# Altium schematic sheet [2] - PWR.SchDoc
size A4
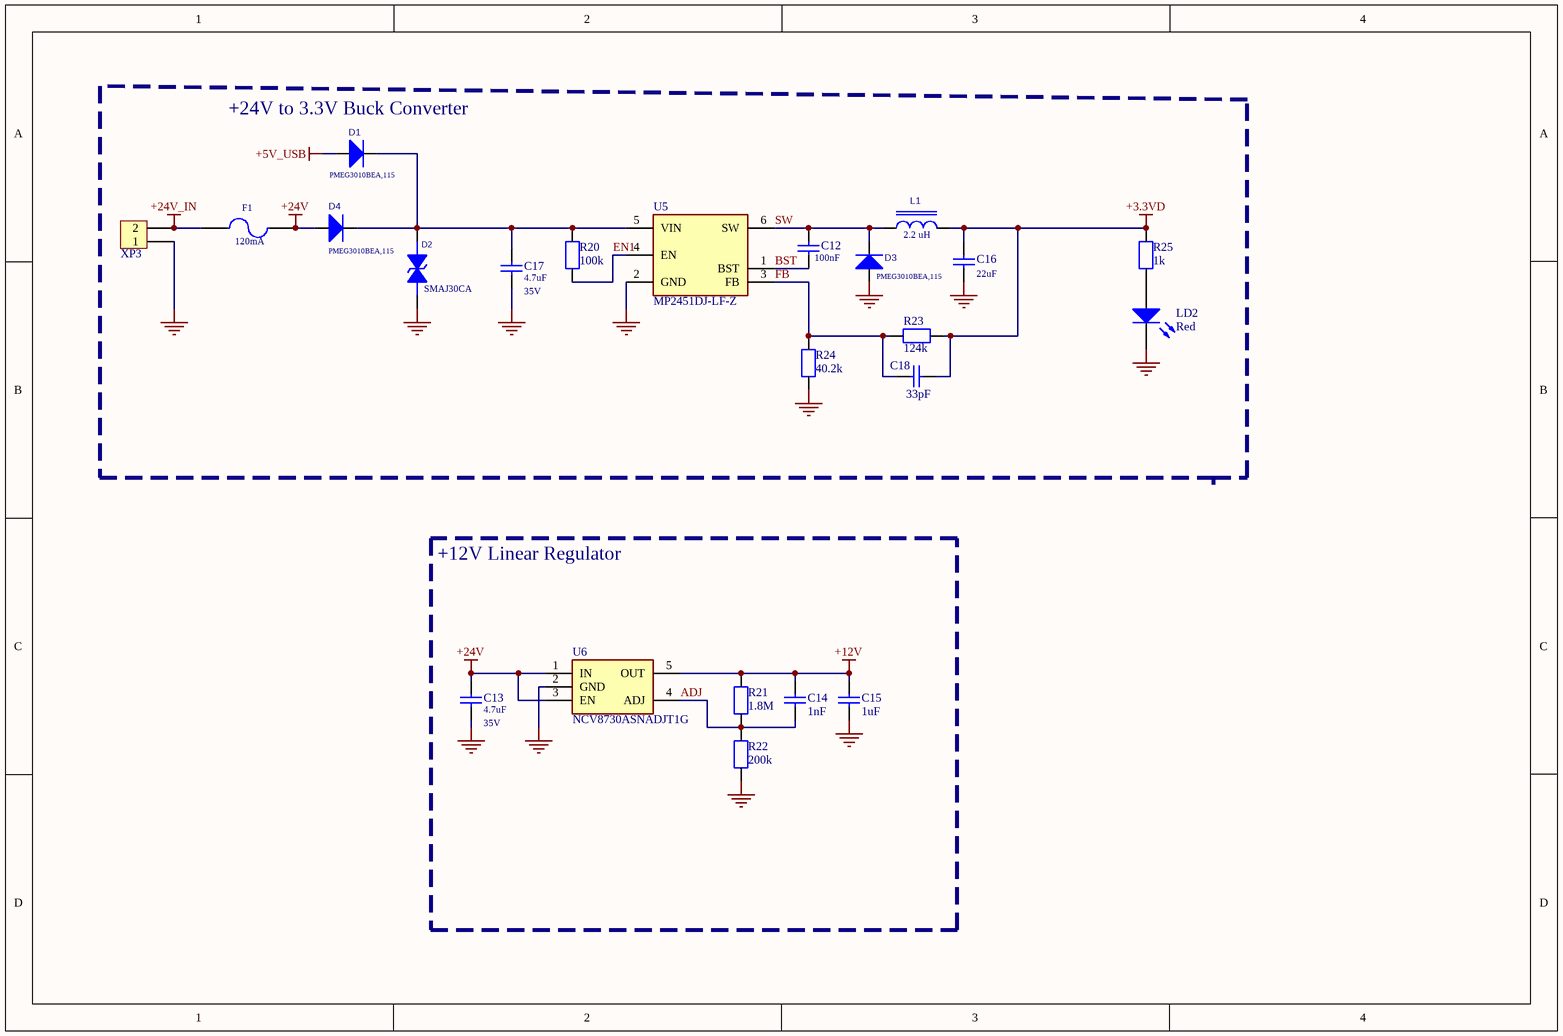
[diagram p0: [2] - PWR.SchDoc]

## Parts
C12  100nF  [CC0603]
C13  4.7uF  Working Voltage: 35V  [CC0805]
C14  1nF  [CC0603]
C15  1uF  [CC0603]
C16  22uF  [CC0805]
C17  4.7uF  Working Voltage: 35V  [CC0805]
C18  33pF  [CC0603]
D1  Manufacturer Part Number: PMEG3010BEA,115  [SOD323]  (hidden comment: Diode)
D2  SMAJ30CA  [SMA]
D3  Manufacturer Part Number: PMEG3010BEA,115  [SOD323]  (hidden comment: Diode)
D4  PMEG3010BEA,115  [SOD323]
F1  Current: 120mA  [FUSE1206]  (hidden comment: 0ZCJ0016FF2E)
L1  value 2.2 uH  [TYS30102R2N10]  (hidden comment: TYS30102R2N-10)
LD2  Color: Red  [LED0603]  (hidden comment: LED)
R20  100k  [RC0603]
R21  1.8M  [RC0603]
R22  200k  [RC0603]
R23  124k  [RC0603]
R24  40.2k  [RC0603]
R25  1k  [RC0603]
U5  MP2451DJ-LF-Z  [SOT95P280X110-6N]
U6  NCV8730ASNADJT1G  [SOT95P275X110-5N]
XP3  Header 2x1pins  [MC 1,5_2-G-3,81]  (value not drawn)

## Blocks framed on the sheet
+12V Linear Regulator: C13-C15 R21 R22 U6

## Nets
+3.3VD: C16.1 C18.2 L1.2 R23.2 R25.2
+5V_USB: D1.2(A)
+12V: C14.1 C15.1 R21.2 U6.5(OUT)
+24V: C13.1 D4.2(A) F1.2 U6.1(IN) U6.3(EN)
+24V_IN: F1.1 XP3.2
GND: C13.2 C15.2 C16.2 C17.2 D2.1 D3.2(A) LD2.1(K) R22.1 R24.2 U5.2(GND) U6.2(GND) XP3.1
ADJ: C14.2 R21.1 R22.2 U6.4(ADJ)
BST: C12.2 U5.1(BST)
EN1: R20.2 U5.4(EN)
FB: C18.1 R23.1 R24.1 U5.3(FB)
SW: C12.1 D3.1(K) L1.1 U5.6(SW)
NetC17_1: C17.1 D1.1(K) D2.2 D4.1(K) R20.1 U5.5(VIN)
NetLD2_2: LD2.2(A) R25.1

## Notes on the sheet
- (near D1) +24V to 3.3V Buck Converter
- Title:
- Number:
- Date:
- Time:
- Revision:
- Sheet
- of
- Drawn by :
- Checked by :
- Approved by :
- Variant:
- Black Nova. All Right Reserved - Copyright 2022

## Library data of the parts
C12 = Capacitors_SMD: SMD Multilayer Ceramic Capacitor, 0.1 µF, 50 V, 0603 [1608 Metric], ± 10%, X7R, MC; Manufacturer: MULTICOMP; Manufacturer Part Number: MC0603B104K500CT; TCC: +/-30ppm; Tolerance: +/-10%; Working Voltage: 50V; ESR ESL: 0.1Ohm/100MHz; Leakage Current: 10uA; PatternType: 0603; Value: 100nF; Material: Ceramic; Dielectric: X7R; Operating Temperature Range: -55C to 125C; Digikey Link: https://www.digikey.com/product-detail/en/avx-corporation/06033C104KAT2A/478-3714-1-ND/1116412
C13 C17 = Capacitors_SMD_10: SMD Multilayer Ceramic Capacitor, 4.7 µF, 35 V, 0805 [2012 Metric], ± 10%, X7R, CGA; Manufacturer: TDK; Manufacturer Part Number: CGA4J1X7R1V475K125AC; TCC: +/-30ppm; Tolerance: +/-10%; ESR ESL: 0.1Ohm/100MHz; Leakage Current: 10uA; PatternType: 0805; Value: 4.7uF; Material: Ceramic; Dielectric: X7R; Operating Temperature Range: -55C to 125C
C14 = Capacitors_SMD_6: CERAMIC CAPACITOR 1000PF, 50V, X7R, 20%, 0603; Manufacturer: MULTICOMP; Manufacturer Part Number: MC0603B102M500CT; TCC: +/-30ppm; Tolerance: +/-20%; ESR ESL: 0.1Ohm/100MHz; Leakage Current: 10uA; PatternType: 0603; Value: 1nF; Working Voltage: 50V; Material: Ceramic; Dielectric: X7R; Operating Temperature Range: -55C to 125C; Mouser Link: *; Digikey Link: *
C15 = Capacitors_SMD: SMD Multilayer Ceramic Capacitor, 1 µF, 16 V, 0603 [1608 Metric], ± 10%, X7R, MC; Manufacturer: MULTICOMP; Manufacturer Part Number: MC0603B105K160CT; TCC: +/-30ppm; Tolerance: +/-10%; Working Voltage: 16V; ESR ESL: 0.1Ohm/100MHz; Leakage Current: 10uA; PatternType: 0603; Value: 1uF; Material: Ceramic; Dielectric: X7R; Operating Temperature Range: -55C to 125C; Mouser Link: *; Farnell Link: https://uk.farnell.com/w/c/passive-components/capacitors/ceramic-capacitors/smd-ceramic-multilayer-mlcc-capacitors?brand=pro-power|stellar-labs|pro-elec|defender-security|duratool|tenma|mcm-custom-audio|pro-signal|mcm|multicomp&ceramic-capacitor-case=0603-1608-metric-&capacitance=1uf; Digikey Link: *
C16 = Capacitors_SMD_10: SMD Multilayer Ceramic Capacitor, 22 µF, 6.3 V, 0805 [2012 Metric], ± 20%, X5R, GRM Series; Manufacturer: MURATA; Manufacturer Part Number: GRM21BR60J226ME39K; TCC: +/-30ppm; Tolerance: +/-10%; Working Voltage: 6.3V; ESR ESL: 0.1Ohm/100MHz; Leakage Current: 10uA; PatternType: 0805; Value: 22uF; Material: Ceramic; Dielectric: X5R; Operating Temperature Range: -55C to 125C
C18 = Capacitors_SMD_14: SMD Multilayer Ceramic Capacitor, 33 pF, 50 V, 0603 [1608 Metric], ± 5%, C0G / NP0, MC; Manufacturer: MULTICOMP; Manufacturer Part Number: MC0603N330J500CT; TCC: +/-30ppm; Tolerance: +/-5%; Working Voltage: 50; Dielectric: COG (NPO); ESR ESL: 0.1Ohm/100MHz; Leakage Current: 10uA; PatternType: 0603; Value: 33pF; Material: Ceramic; Operating Temperature Range: -55C to 125C; Mouser Link: *; Farnell Link: https://www.newark.com/search?st=MC0603N330J500CT; Digikey Link: *
D1 D3 = 1N4148WS: Schottky Rectifier, Barrier, 30 V, 1 A, Single, SOD-323, 2 Pins, 560 mV; Manufacturer: NEXPERIA; Current: 1A; Voltage: 30V; Pb Free: Yes; Part Number: PMEG3010BEA,115; Temperature: -65 - +150C; Component Type: Standard; Case: SOD323; ComponentLink2Description: Datasheet; STATUS: https://4donline.ihs.com/images/VipMasterIC/IC/PHGL/PHGLS19535/PHGLS19689-1.pdf?hkey=6D3A4C79FDBF58556ACFDE234799DDF0
D2 = 3.0SMI30CA: TVS Diode, TRANSZORB SMAJ, Bidirectional, 30 V, 48.4 V, DO-214AC (SMA), 2 Pins; Manufacturer: BOURNS; Voltage: 30V; Pb Free: Yes; Part Number: SMAJ30CA; Analogs: SMAJ30CA; Temperature: -55 - +150 C; Manufacturer Part Number: SMAJ30CA; Component Type: Standard; Case: SMA; ComponentLink2Description: Datasheet; ComponentLink2URL: https://www.farnell.com/datasheets/2076055.pdf
D4 = PMEG3010BEA,115: Schottky Rectifier, Barrier, 30 V, 1 A, Single, SOD-323, 2 Pins, 560 mV; Manufacturer: NEXPERIA; Current: 1A; Voltage: 30V; Pb Free: Yes; Manufacturer Part Number: PMEG3010BEA,115; Temperature: -65 - +150C; Component Type: Standard; Case: SOD323; ComponentLink2Description: Datasheet; STATUS: https://4donline.ihs.com/images/VipMasterIC/IC/PHGL/PHGLS19535/PHGLS19689-1.pdf?hkey=6D3A4C79FDBF58556ACFDE234799DDF0
F1 = 0ZCJ0016FF2E: RESETTABLE FUSE, PTC, 48VDC, 120mA, SMD, FULL REEL; Part Number: NANOSMDC012F-2; Manufacturer: LITTELFUSE; Pb Free: Yes; Voltage: 48VDC; Temperature: -40 - +85 C; Manufacturer Part Number: NANOSMDC012F-2; Component Type: Standard; Case: FUSE1206; ComponentLink2Description: Datasheet; ComponentLink2URL: https://4donline.ihs.com/images/VipMasterIC/IC/LFSI/LFSI-S-A0002814467/LFSI-S-A0002814467-1.pdf?hkey=6D3A4C79FDBF58556ACFDE234799DDF0
L1 = IFSC1515AHER2R2M01: Power Inductor (SMD), 2.2 µH, 1.09 A, Shielded, 1.15 A, TYS; Manufacturer: LAIRD; DC Current: 1.09A; Tolerance: 30%; DC Resistance: 0,11; Pb Free: Yes; Part Number: TYS30102R2N-10; Temperature: -55 - +125 C; Manufacturer Part Number: TYS30102R2N-10; Component Type: Standard; ComponentLink2Description: Datasheet; ComponentLink2URL: https://4donline.ihs.com/images/VipMasterIC/IC/LATE/LATE-S-A0003320560/LATE-S-A0003320560-1.pdf?hkey=6D3A4C79FDBF58556ACFDE234799DDF0
LD2 = TLMS1000-GS08: LED RED 0603 SMD; Manufacturer: Vishay Semiconductors; Current: 2mA; Voltage: 1.8V; Part Number: TLMS1000-GS08; Temperature: -40 - +100 C; Manufacturer Part Number: TLMS1000-GS08; Component Type: Standard; Case: LED0603; ComponentLink2Description: Datasheet; ComponentLink2URL: http://www.vishay.com/docs/83172/tlmo1000.pdf; Published: 04.12.2013; Publisher: dlegkobyt; STATUS: CHECKED
R20 = Resistors_SMD_4: SMD Chip Resistor, 100 kohm, ± 1%, 100 mW, 0603 [1608 Metric], Thick Film, General Purpose; Manufacturer: MULTICOMP; Manufacturer Part Number: MCWR06X1003FTL; TCR: +/-100ppm/C; Tolerance: +/-1%; Working Voltage: 0402, 0603 =75V, 0805 =100V, 1206 =200V; Power Rating: 0402 =50, 0603 =150, 0805 =200, 1206 =400mW; PatternType: 0603; Value: 100k; Operating Temperature Range: -55C to 250C; Material: Titalum nitride; Mouser Link: *; Digikey Link: *; Farnell Link: https://uk.farnell.com/w/search/prl/results?st=MCWR06X1003FTL&scope=partnumberlookahead&searchref=searchlookahead
R21 = Resistors_SMD_4: SMD Chip Resistor, 1.8 Mohm, ± 1%, 100 mW, 0603 [1608 Metric], Thick Film, General Purpose; Manufacturer: YAGEO; Manufacturer Part Number: RC0603FR-071M8L; TCR: +/-100ppm/C; Tolerance: +/-1%; Working Voltage: 0402, 0603 =75V, 0805 =100V, 1206 =200V; Power Rating: 0402 =50, 0603 =150, 0805 =200, 1206 =400mW; PatternType: 0603; Value: 1.8M; Operating Temperature Range: -55C to 250C; Material: Titalum nitride; Mouser Link: *; Digikey Link: *
R22 = Resistors_SMD_4: SMD Chip Resistor, 200 kohm, ± 1%, 100 mW, 0603 [1608 Metric], Thick Film, General Purpose; Manufacturer: YAGEO; Manufacturer Part Number: RC0603FR-07200KL; TCR: +/-100ppm/C; Tolerance: +/-1%; Working Voltage: 0402, 0603 =75V, 0805 =100V, 1206 =200V; Power Rating: 0402 =50, 0603 =150, 0805 =200, 1206 =400mW; PatternType: 0603; Value: 200k; Operating Temperature Range: -55C to 250C; Material: Titalum nitride; Mouser Link: *; Digikey Link: *
R23 = Resistors_SMD_4: SMD Chip Resistor, 124 kohm, ± 1%, 100 mW, 0603 [1608 Metric], Thick Film, General Purpose; Manufacturer: YAGEO; Manufacturer Part Number: RC0603FR-07124KL; TCR: +/-100ppm/C; Tolerance: +/-1%; Working Voltage: 0402, 0603 =75V, 0805 =100V, 1206 =200V; Power Rating: 0402 =50, 0603 =150, 0805 =200, 1206 =400mW; PatternType: 0603; Value: 124k; Operating Temperature Range: -55C to 250C; Material: Titalum nitride; Mouser Link: *; Digikey Link: *
R24 = Resistors_SMD_4: Thick Film Resistors - SMD 32.4 Ohms 100 mW 0603 1%; Manufacturer: YAGEO; Manufacturer Part Number: RC0603FR-1340K2L; TCR: +/-100ppm/C; Tolerance: +/-1%; Working Voltage: 0402, 0603 =75V, 0805 =100V, 1206 =200V; Power Rating: 0402 =50, 0603 =150, 0805 =200, 1206 =400mW; PatternType: 0603; Value: 40.2k; Operating Temperature Range: -55C to 250C; Material: Titalum nitride; Mouser Link: *; Digikey Link: *
R25 = Resistors_SMD: SMD Chip Resistor, 1 kohm, ± 1%, 100 mW, 0603 [1608 Metric], Thick Film, General Purpose; Manufacturer: MULTICOMP; Manufacturer Part Number: MCWR06X1001FTL; TCR: +/-100ppm/C; Tolerance: +/-1%; Working Voltage: 0402, 0603 =75V, 0805 =100V, 1206 =200V; Power Rating: 0402 =50, 0603 =150, 0805 =200, 1206 =400mW; PatternType: 0603; Value: 1k; Operating Temperature Range: -55C to 250C; Material: Titalum nitride; Mouser Link: *; Digikey Link: *; Farnell Link: https://uk.farnell.com/multicomp/mcwr06x1001ftl/res-1k-1-0-1w-0603-thick-film/dp/2447272
U5 = MP2451DJ-LF-Z: DC-DC Switching Buck (Step Down) Regulator, 3.3V-36V in, 800mV to 28.8V out, 600mA, 2MHz, TSOT-23-6; Manufacturer: MPS; Manufacturer Part Number: MP2451DJ-LF-Z; Working Voltage: 3.3V-36V
U6 = NCV8730ASNADJT1G: LDO, ADJ, 0.15A, Input Voltage Max 38V, -40 TO 125DEG C; Manufacturer: Onsemi; Working Voltage: 2.7V-38V; Datasheet Link: https://www.arrow.com/en/products/ncv8730asnadjt1g/on-semiconductor; Height: 1.1mm; Manufacturer Part Number: NCV8730ASNADJT1G; Mouser Part Number: 863-NCV8730ASNADJT1G; Mouser Price/Stock: https://www.mouser.co.uk/ProductDetail/onsemi/NCV8730ASNADJT1G?qs=GedFDFLaBXFZJgT1iqVkOg%3D%3D; Arrow Part Number: NCV8730ASNADJT1G; Arrow Price/Stock: https://www.arrow.com/en/products/ncv8730asnadjt1g/on-semiconductor?region=nac
XP3 = MC 1,5/ 2-G-3,81: Terminal Block, Header, 3.81 mm, 2 Ways, 8 A, 160 V, Through Hole Right Angle; Manufacturer: PHOENIX CONTACT; Permitted current: 8A; Pins number: 2; Pb Free: Yes; Part Number: MC 1,5/ 2-G-3,81; Temperature: -40 - +105 C; Manufacturer Part Number: MC 1,5/ 2-G-3,81; Component Type: Standard; Case: MC 1,5_2-G-3,81; ComponentLink2Description: Datasheet; Published: 14.11.2013; Publisher: dlegkobyt; STATUS: CHECKED